# Altium schematic sheet Interface.SchDoc
size A4; SheetNumber: 12; SheetTotal: 15
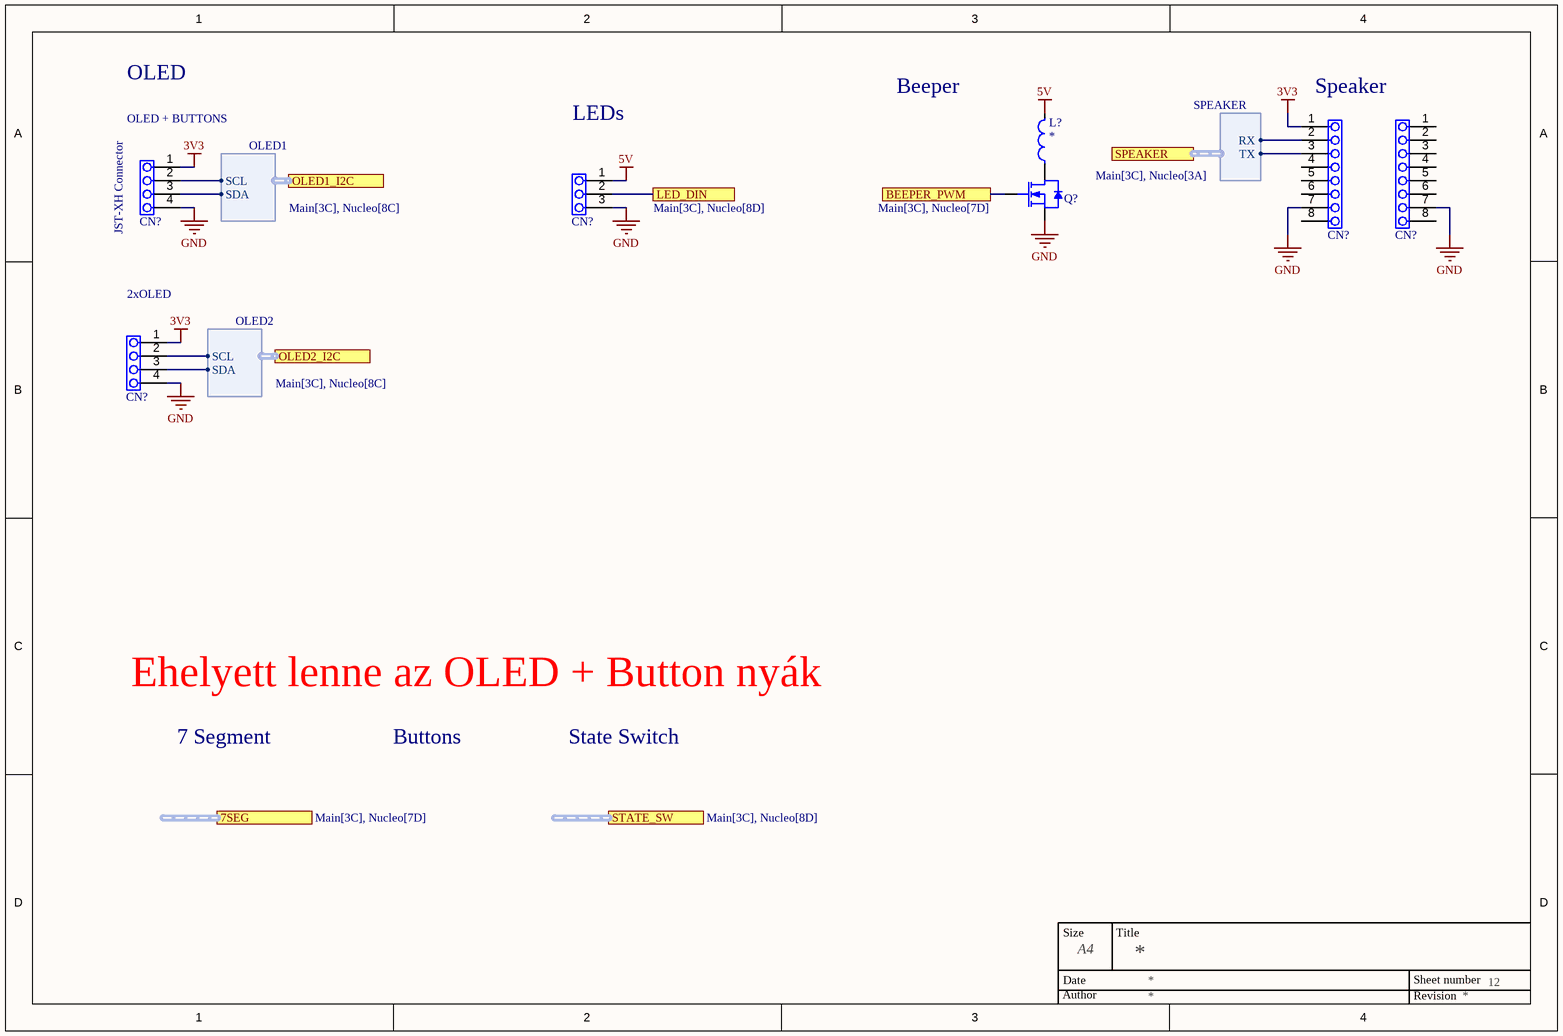
[diagram p0: Interface.SchDoc]

## Parts
(Parts that share a designator on the sheet are numbered #1, #2 ... from top to bottom, then left to right.)
CN?#1  Pin-1x8  [PIN-1X7]  (value not drawn)
CN?#2  Pin-1x8  [PIN-1X7]  (value not drawn)
CN?#3  Pins 1x3  [PIN-1X4]  (value not drawn)
CN?#4  Pins 1x3  [PIN-1X3]  (value not drawn)
CN?#5  Pins 1x3  [PIN-1X4]  (value not drawn)
L?  *
Q?  N-MOSFET  (value not drawn)

## Ports
7SEG (see Main[3C], Nucleo[7D]), BEEPER_PWM (see Main[3C], Nucleo[7D]), LED_DIN (see Main[3C], Nucleo[8D]), OLED1_I2C (harness OLED1, see Main[3C], Nucleo[8C]), OLED2_I2C (harness OLED2, see Main[3C], Nucleo[8C]), SPEAKER (harness SPEAKER, see Main[3C], Nucleo[3A]), STATE_SW (see Main[3C], Nucleo[8D])

## Harnesses
OLED1: SCL, SDA
OLED2: SCL, SDA
SPEAKER: RX, TX

## Nets
3V3: CN?#1.1 CN?#3.1 CN?#5.1
5V: CN?#4.1 L?.2
GND: CN?#1.7 CN?#2.7 CN?#3.4 CN?#4.3 CN?#5.4 Q?.2(S)
BEEPER_PWM: Q?.1(G) ; port BEEPER_PWM
LED_DIN: CN?#4.2 ; port LED_DIN
NetCN?#1_2: CN?#1.2 ; port SPEAKER.RX
NetCN?#1_3: CN?#1.3 ; port SPEAKER.TX
NetCN?#3_2: CN?#3.2 ; port OLED1_I2C.SCL
NetCN?#3_3: CN?#3.3 ; port OLED1_I2C.SDA
NetCN?#5_2: CN?#5.2 ; port OLED2_I2C.SCL
NetCN?#5_3: CN?#5.3 ; port OLED2_I2C.SDA
NetL?_1: L?.1 Q?.3(D)

Not connected (* = marked no-connect by the designer): CN?#1 4 5 6 8; CN?#2 1 2 3 4 5 6 8

## Notes on the sheet
- OLED
- Beeper
- (near CN?#1) Speaker
- (near CN?#3) OLED + BUTTONS
- LEDs
- (near CN?#3) JST-XH Connector
- (near CN?#5) 2xOLED
- Ehelyett lenne az OLED + Button nyák
- 7 Segment
- Buttons
- State Switch
- Size
- Date
- A4
- Title
- Sheet number
- Author
- Revision

## Library data of the parts
CN?#1 CN?#2 = Pin-1x8: 2.54mm; Part Class: Connector; Order Code: 855-M50-3530342; CompType: M50-3530342; Distributor: Mouser; Package: SMD 1.27mm
CN?#3 CN?#5 = Pin-1x4: 2.54mm; Part Class: Connector; Order Code: 855-M50-3530342; CompType: M50-3530342; Distributor: Mouser; Package: SMD 1.27mm
CN?#4 = Pin-1x3: 2.54mm; Part Class: Connector; Order Code: 855-M50-3530342; CompType: M50-3530342; Distributor: Mouser; Package: SMD 1.27mm
L? = Inductor: Value: *
Q? = N-MOSFET: N channel MOSFET